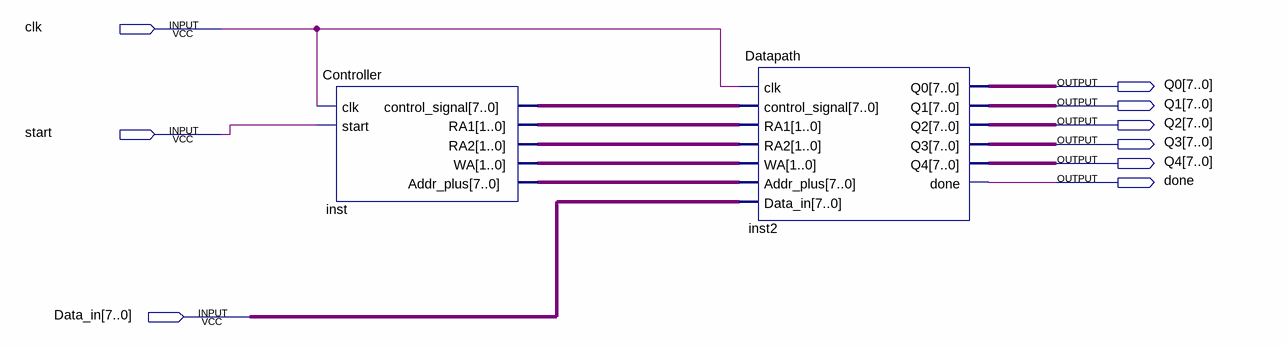
[diagram p0: schematic sheet]
// Quartus schematic Top.bdf as structural Verilog: 2 symbols, 9 pins
module Top (
  input  clk,
  input  start,
  input  [7:0] Data_in,
  output [7:0] Q0,
  output [7:0] Q1,
  output [7:0] Q2,
  output [7:0] Q3,
  output [7:0] Q4,
  output done
);

  wire [1:0] inst_ra1, inst_ra2, inst_wa;
  wire [7:0] inst_addr_plus, inst_control_signal;

  Controller inst (
    .clk(clk), .start(start), .control_signal(inst_control_signal), .RA1(inst_ra1), .RA2(inst_ra2),
    .WA(inst_wa), .Addr_plus(inst_addr_plus));
  Datapath inst2 (
    .clk(clk), .control_signal(inst_control_signal), .RA1(inst_ra1), .RA2(inst_ra2), .WA(inst_wa),
    .Addr_plus(inst_addr_plus), .Data_in(Data_in), .Q0(Q0), .Q1(Q1), .Q2(Q2), .Q3(Q3), .Q4(Q4), .done(done));
endmodule
